# Altium schematic sheet 3 - 19V Buck.SchDoc: 19V Buck
size Letter; DrawnBy: Adrianna Ascalon; Organization: UW Robotics; Address1: 200 University Avenue; Address2: Waterloo; Address3: Ontario; Address4: Canada N2L 3G6
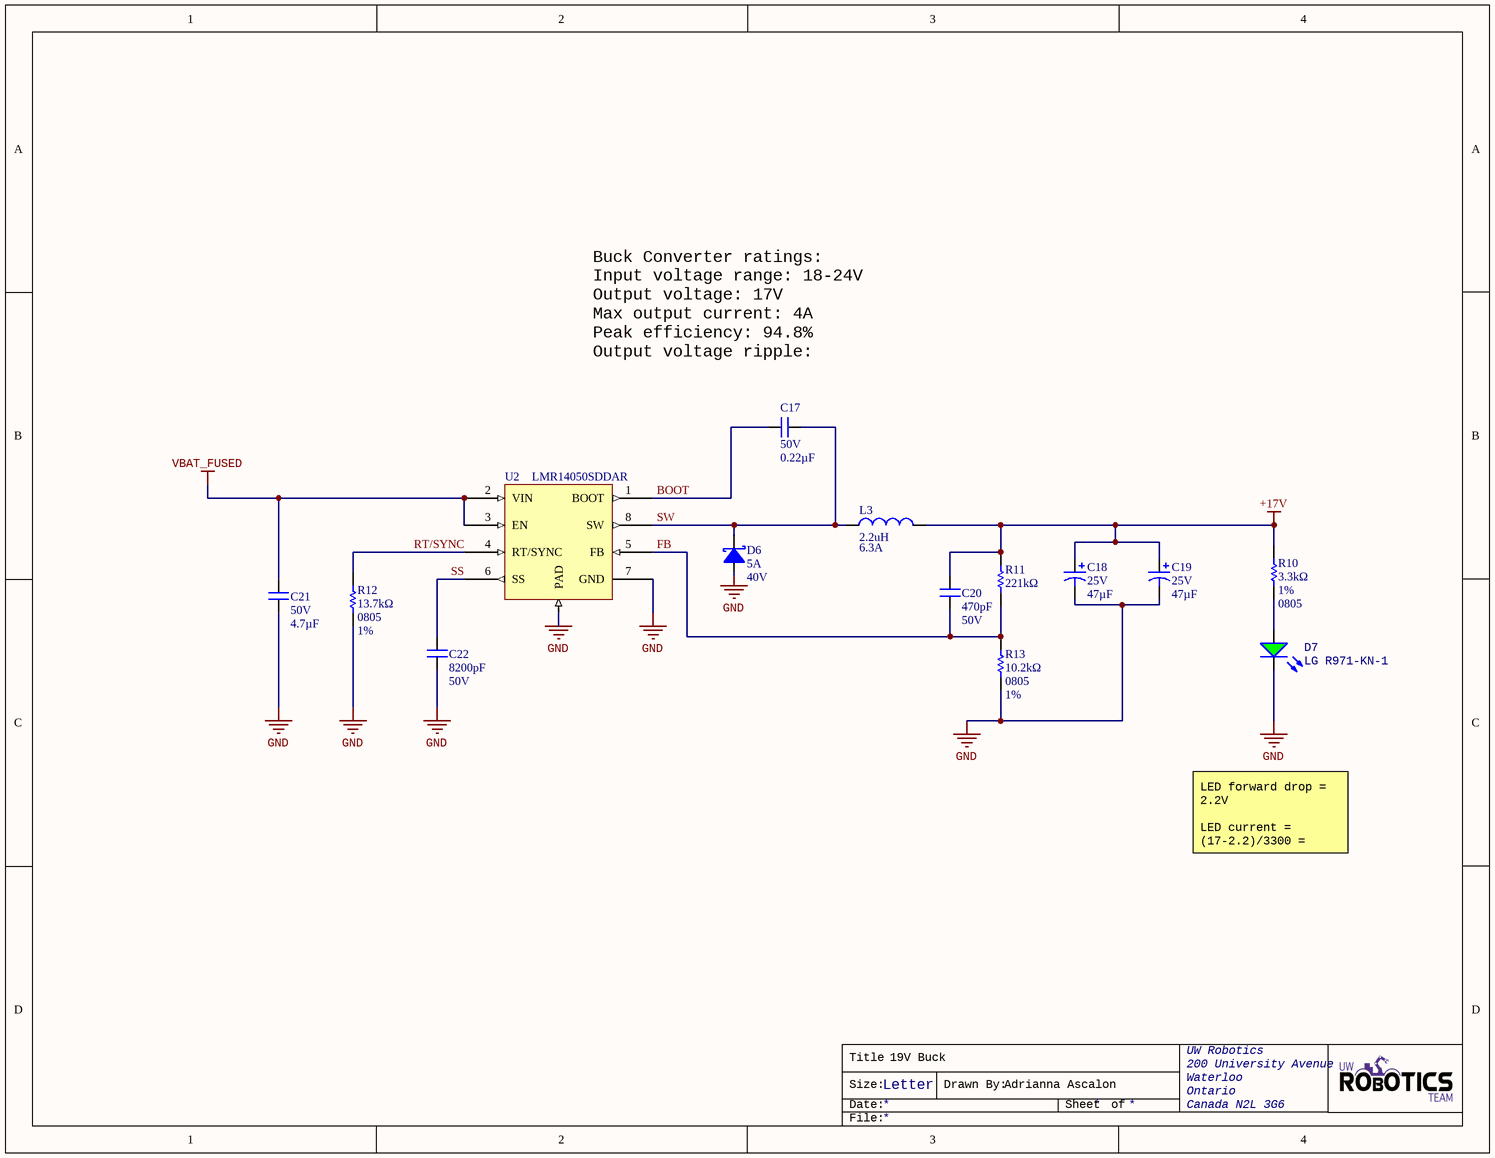
[diagram p0: 3 - 19V Buck.SchDoc]

## Parts
C17  Voltage Rating: 50V  Capacitance: 0.22µF  [CAP 0805_2012]  (hidden comment: GRM21BR71H224MA01L)
C18  Voltage: 25V  [25SVPF47M]  (hidden comment: 47μF)
C19  Voltage: 25V  [25SVPF47M]  (hidden comment: 47μF)
C20  470pF  Voltage Rating: 50V  [CAP 0805_2012]
C21  Voltage Rating: 50V  Capacitance: 4.7µF  [CAPC1206(3216)]  (hidden comment: GRM31CR71H475KA12L)
C22  8200pF  Voltage Rating: 50V
D6  Forward Current: 5A  Voltage: 40V  [DO214AB SMC]  (hidden comment: B540C-13-F)
D7  LG R971-KN-1  [LED_0805_LINE]
L3  Inductance: 2.2uH  Max DC Current: 6.3A  [IND_BOURNS_SRN80]  (hidden comment: SRN8040-2R2Y)
R10  3.3kΩ  Tolerance: 1%  Case Code (Imperial): 0805
R11  221kΩ  [RESC2012X60N]
R12  13.7kΩ  Case Code (Imperial): 0805  Tolerance: 1%  [RESC2012X60N]
R13  10.2kΩ  Case Code (Imperial): 0805  Tolerance: 1%  [RESC2012X60N]
U2  LMR14050SDDAR  [DDA8]

## Nets
+17V: C18.1 C19.1 C20.2 L3.2 R10.2 R11.2
GND: C18.2 C19.2 C21.2 C22.1 D6.1(Anode) D7.2(K) R12.1 R13.1 U2.7(GND) U2.9(PAD)
VBAT_FUSED: C21.1 U2.2(VIN) U2.3(EN)
BOOT: C17.2 U2.1(BOOT)
FB: C20.1 R11.1 R13.2 U2.5(FB)
RT/SYNC: R12.2 U2.4(RT/SYNC)
SS: C22.2 U2.6(SS)
SW: C17.1 D6.2(Cathode) L3.1 U2.8(SW)
NetD7_1: D7.1(A) R10.1

## Notes on the sheet
- Buck Converter ratings:
  Input voltage range: 18-24V
  Output voltage: 17V
  Max output current: 4A
  Peak efficiency: 94.8%
  Output voltage ripple: 19.45mVpp
- LED forward drop = 2.2V
  LED current = (17-2.2)/3300 = 4.5mA
- Title
- Size:
- Date:
- Letter
- Drawn By:
- Sheet
- of
- File:

## Library data of the parts
C17 = GRM21BR71H224MA01L: CAP CER 0.22UF 50V X7R 0805; Manufacturer 1: Murata; Tolerance: 20%; Manufacturer Part Number 1: GRM21BR71H224MA01L; Stock 1: 7809; Pricing 1: 1=0.33000, 10=0.23100, 100=0.13850, 500=0.10388, 1000=0.08772 (USD); RoHS: Yes; Mount: Surface Mount; Case/Package: 0805; Case Code (Metric): 2012; Case Code (Imperial): 0805; Min Operating Temperature: -55°C; Max Operating Temperature: 125°C; Package Quantity: 1; Packaging: Tape and Reel; Dielectric: X7R; Termination: SMD/SMT; Voltage Rating (DC): 50V; Length: 2mm; Height: 1.25mm; Width: 0.049inch; Thickness: 0.053inch; Depth: 1.25mm; Radiation Hardening: No; Lead Free: Lead Free; ComponentLink1URL: https://datasheet.ciiva.com/5421/product-5421097.pdf?src-supplier=Mouser; ComponentLink1Description: https://datasheet.ciiva.com/5421/product-5421097.pdf?src-supplier=Mouser; ComponentLink2URL: https://datasheet.ciiva.com/136/partnumbering-e-01-136536.pdf?src-supplier=Digi-Key; ComponentLink2Description: https://datasheet.ciiva.com/136/partnumbering-e-01-136536.pdf?src-supplier=Digi-Key; ComponentLink3URL: https://datasheet.ciiva.com/136/partnumbering-e-01-136537.pdf?src-supplier=Digi-Key; ComponentLink3Description: https://datasheet.ciiva.com/136/partnumbering-e-01-136537.pdf?src-supplier=Digi-Key; ComponentLink4URL: https://datasheet.ciiva.com/136/partnumbering-e-01-136538.pdf?src-supplier=Digi-Key; ComponentLink4Description: https://datasheet.ciiva.com/136/partnumbering-e-01-136538.pdf?src-supplier=Digi-Key; Supplier 1: Digi-Key; Supplier Part Number 1: 490-1671-1-ND; Package: 0805 (2012 Metric)
C18 C19 = 25SVPF47M: CAP ALUM POLY 47UF 20% 25V SMD; Manufacturer 1: Panasonic; Polarity: Polar; Leakage Current: 235uA; Life (Hours): 5000Hour; Dissipation Factor: 12%; ESR (Equivalent Series Resistance): 30mR; Ripple Current: 2.8A; Clamping Voltage: 35.5V; Peak Pulse Power: 400W; Reverse Standoff Voltage: 22V; Peak Pulse Current: 11.3A; Test Current: 1mA; Breakdown Voltage: 24.4V; Number of Channels: 1; Direction: Unidirectional; Max Reverse Leakage Current: 1uA; Element Configuration: Single; Max Breakdown Voltage: 26.9V; Max Forward Surge Current (Ifsm): 40A; Working Voltage: 3.5V; Current: 113A; Supplier 1: Digi-Key; Manufacturer Part Number 1: 25SVPF47M; Stock 1: 6381; Pricing 1: 1=1.29000, 10=1.02200, 100=0.76620, 500=0.57888 (USD); RoHS: Yes; Mount: Surface Mount; Case/Package: Radial; Number of Pins: 6; Min Operating Temperature: -55°C; Max Operating Temperature: 105°C; Termination: SMD/SMT; Tolerance: 20%; Packaging: Tape and Reel; Package Quantity: 1; Voltage Rating: 25V; Ripple Current (AC): 2.8A; Voltage Rating (DC): 25V; Diameter: 6.3mm; Length: 5.9mm; Height: 5.9mm; Height - Seated (Max): 0.236inch; REACH SVHC: No SVHC; ComponentLink1URL: https://datasheet.ciiva.com/22746/1734360-22746218.pdf?src-supplier=Element14; ComponentLink1Description: https://datasheet.ciiva.com/22746/1734360-22746218.pdf?src-supplier=Element14; ComponentLink2URL: https://datasheet.ciiva.com/24025/svpf-os-262415-24025725.pdf?src-supplier=Mouser; ComponentLink2Description: https://datasheet.ciiva.com/24025/svpf-os-262415-24025725.pdf?src-supplier=Mouser; ComponentLink3URL: https://datasheet.ciiva.com/48542/svpf-eng-ds-48542390.pdf?src-supplier=Distrelec; ComponentLink3Description: https://datasheet.ciiva.com/48542/svpf-eng-ds-48542390.pdf?src-supplier=Distrelec; ComponentLink4URL: https://datasheet.ciiva.com/25746/1734360-25746558.pdf?src-supplier=Farnell; ComponentLink4Description: https://datasheet.ciiva.com/25746/1734360-25746558.pdf?src-supplier=Farnell; Supplier Part Number 1: P16513CT-ND; Capacitance: 47µF; Max Surge Current: 11.3A; Operating Supply Voltage: 22V; Min Breakdown Voltage: 24.4V; Number of Elements: 1; Reverse Breakdown Voltage: 24.4V; Max Power Dissipation: 400W; Power Dissipation: 400W; Width: 0.11inch; Radiation Hardening: No; Lead Free: Lead Free; ComponentLink5URL: https://datasheet.ciiva.com/18426/70217282-18426662.pdf?src-supplier=Allied+Electronics; ComponentLink5Description: https://datasheet.ciiva.com/18426/70217282-18426662.pdf?src-supplier=Allied+Electronics; ComponentLink6URL: https://datasheet.ciiva.com/4508/smaj50a-241759-4508681.pdf?src-supplier=Mouser; ComponentLink6Description: https://datasheet.ciiva.com/4508/smaj50a-241759-4508681.pdf?src-supplier=Mouser
C20 = CAP_470pF_50V_0805: CAP CER 470PF 50V X7R 0805; Manufacturer 1: Kyocera AVX; Manufacturer Part Number 1: 08055C471JAT2A; Tolerance: 5%; Dissipation Factor: 2.5%; Supplier 1: Digi-Key; Stock 1: 6535; Pricing 1: 1=0.32000, 10=0.22000, 100=0.12470, 500=0.08804, 1000=0.07704 (USD); RoHS: Yes; Mount: Surface Mount; Number of Pins: 2; Case Code (Metric): 2012; Case Code (Imperial): 0805; Min Operating Temperature: -55°C; Max Operating Temperature: 125°C; Dielectric: X7R; Package Quantity: 1; Packaging: Tape and Reel; Voltage Rating (DC): 50V; Termination: SMD/SMT; Length: 2.01mm; Height: 0.94mm; Width: 0.049inch; Thickness: 0.037inch; Depth: 1.25mm; Radiation Hardening: No; REACH SVHC: Unknown; ComponentLink1URL: https://datasheet.ciiva.com/17487/cx7r-17487814.pdf?src-supplier=Avnet+Europe; ComponentLink1Description: https://datasheet.ciiva.com/17487/cx7r-17487814.pdf?src-supplier=Avnet+Europe; ComponentLink2URL: https://datasheet.ciiva.com/7614/cx7r-7614649.pdf?src-supplier=Digi-Key; ComponentLink2Description: https://datasheet.ciiva.com/7614/cx7r-7614649.pdf?src-supplier=Digi-Key; ComponentLink3URL: https://datasheet.ciiva.com/206/cx7r-206811.pdf?src-supplier=Digi-Key; ComponentLink3Description: https://datasheet.ciiva.com/206/cx7r-206811.pdf?src-supplier=Digi-Key; ComponentLink4URL: https://datasheet.ciiva.com/14906/cx7r-14906251.pdf?src-supplier=Digi-Key; ComponentLink4Description: https://datasheet.ciiva.com/14906/cx7r-14906251.pdf?src-supplier=Digi-Key; ComponentLink5URL: https://datasheet.ciiva.com/11521/cx7r-11521036.pdf?src-supplier=Avnet; ComponentLink5Description: https://datasheet.ciiva.com/11521/cx7r-11521036.pdf?src-supplier=Avnet; ComponentLink6URL: https://datasheet.ciiva.com/5415/cx7r-218113-5415709.pdf?src-supplier=Mouser; ComponentLink6Description: https://datasheet.ciiva.com/5415/cx7r-218113-5415709.pdf?src-supplier=Mouser; ComponentLink7URL: https://datasheet.ciiva.com/14906/cx7r-14906253.pdf?src-supplier=Digi-Key; ComponentLink7Description: https://datasheet.ciiva.com/14906/cx7r-14906253.pdf?src-supplier=Digi-Key; Supplier Part Number 1: 478-7958-1-ND; Capacitance: 470pF; Package: 0805 (2012 Metric); Contact Plating: Tin,Matte
C21 = GRM31CR71H475KA12L: CAP CER 4.7UF 50V X7R 1206; Manufacturer 1: Murata; Material: Ceramic; Tolerance: 10%; Value: 4.7µF; Supplier 1: Digi-Key; Manufacturer Part Number 1: GRM31CR71H475KA12L; Stock 1: 12089; Pricing 1: 1=0.86000, 10=0.63700, 100=0.43660, 500=0.34562, 1000=0.29105 (USD); RoHS: Yes; Mount: Surface Mount; Case/Package: 1206; Case Code (Metric): 3216; Case Code (Imperial): 1206; Min Operating Temperature: -55°C; Max Operating Temperature: 125°C; Dielectric: X7R; Packaging: Tape and Reel; Voltage Rating (DC): 50V; Package Quantity: 2000; Termination: SMD/SMT; Voltage: 50V; Length: 3.2mm; Height: 1.6mm; Width: 0.063inch; Thickness: 0.071inch; Depth: 1.6mm; Radiation Hardening: No; REACH SVHC: No SVHC; Lead Free: Lead Free; ComponentLink1URL: https://datasheet.ciiva.com/6072/415379-6072784.pdf?src-supplier=Farnell; ComponentLink1Description: https://datasheet.ciiva.com/6072/415379-6072784.pdf?src-supplier=Farnell; ComponentLink2URL: https://datasheet.ciiva.com/3777/2267grm31cr71h475ka1223-3777241.pdf?src-supplier=Arrow; ComponentLink2Description: https://datasheet.ciiva.com/3777/2267grm31cr71h475ka1223-3777241.pdf?src-supplier=Arrow; ComponentLink3URL: https://datasheet.ciiva.com/29202/450972-da-01-de-vs-chip-kond-1206-4-7-uf-10pr-50-0v-x7r-29202576.pdf?src-supplier=Conrad; ComponentLink3Description: https://datasheet.ciiva.com/29202/450972-da-01-de-vs-chip-kond-1206-4-7-uf-10pr-50-0v-x7r-29202576.pdf?src-supplier=Conrad; ComponentLink4URL: https://datasheet.ciiva.com/29202/451279-da-01-de-vs-kondens-grm31-cr71h-475ka12l-29202365.pdf?src-supplier=Conrad; ComponentLink4Description: https://datasheet.ciiva.com/29202/451279-da-01-de-vs-kondens-grm31-cr71h-475ka12l-29202365.pdf?src-supplier=Conrad; ComponentLink5URL: https://datasheet.ciiva.com/7937/415310-7937749.pdf?src-supplier=Element14; ComponentLink5Description: https://datasheet.ciiva.com/7937/415310-7937749.pdf?src-supplier=Element14; ComponentLink6URL: https://datasheet.ciiva.com/6270/partnumbering-e-01-6270217.pdf?src-supplier=Digi-Key; ComponentLink6Description: https://datasheet.ciiva.com/6270/partnumbering-e-01-6270217.pdf?src-supplier=Digi-Key; ComponentLink7URL: https://datasheet.ciiva.com/6270/partnumbering-e-01-6270218.pdf?src-supplier=Digi-Key; ComponentLink7Description: https://datasheet.ciiva.com/6270/partnumbering-e-01-6270218.pdf?src-supplier=Digi-Key; ComponentLink8URL: https://datasheet.ciiva.com/6270/partnumbering-e-01-6270219.pdf?src-supplier=Digi-Key; ComponentLink8Description: https://datasheet.ciiva.com/6270/partnumbering-e-01-6270219.pdf?src-supplier=Digi-Key; Supplier Part Number 1: 490-6521-1-ND; Package: 1206 (3216 Metric)
C22 = CAP_8200pF_50V_0805: CAP CER 8200PF 50V X7R 0805; Tolerance: 10%; Capacitance: 8.2nF; RoHS: Yes; Mount: Surface Mount; Case Code (Metric): 2012; Case Code (Imperial): 0805; Min Operating Temperature: -55°C; Max Operating Temperature: 125°C; Dielectric: X7R; Package Quantity: 12000; Voltage Rating (DC): 50V; Termination: SMD/SMT; Packaging: Tape and Reel; Length: 0.079inch; Width: 0.049inch; Thickness: 0.037inch; Depth: 1.25mm; Radiation Hardening: No; ComponentLink1URL: https://datasheet.ciiva.com/205/cauto-205227.pdf?src-supplier=Digi-Key; ComponentLink1Description: https://datasheet.ciiva.com/205/cauto-205227.pdf?src-supplier=Digi-Key; Supplier 1: Digi-Key; Supplier Part Number 1: 478-9924-6-ND; Number of Pins: 2; Ratings: AEC-Q200; Package: 0805 (2012 Metric)
D6 = B540C-13-F: Diode Schottky 40V 5A Surface Mount SMC; Manufacturer 1: Diodes; Element Configuration: Single; Peak Reverse Current: 500uA; Peak Non-Repetitive Surge Current: 100A; Forward Voltage: 550mV; Polarity: Standard; Capacitance: 300pF; Supplier 1: Digi-Key; Manufacturer Part Number 1: B540C-13-F; Stock 1: 27000; Pricing 1: 1=0.49000, 10=0.41700, 25=0.38880, 100=0.28890, 250=0.27440, 500=0.22554, 1000=0.18332 (USD); RoHS: Yes; Mount: Surface Mount; Case/Package: SMC; Number of Pins: 2; Weight: 0.007408oz; Contact Plating: Tin,Matte; Min Operating Temperature: -55°C; Max Operating Temperature: 125°C; Max Repetitive Reverse Voltage (Vrrm): 40V; Packaging: Tape and Reel; Max Forward Surge Current (Ifsm): 100A; Package Quantity: 3000; Average Rectified Current: 5A; Termination: SMD/SMT; Voltage Rating (DC): 40V; Current Rating: 5A; Output Current: 5A; Max Reverse Voltage (DC): 40V; Current: 5A; Length: 7.11mm; Height: 2.5mm; Width: 6.22mm; Radiation Hardening: No; REACH SVHC: No SVHC; Lead Free: Lead Free; ComponentLink1URL: https://datasheet.ciiva.com/914/ds13012-914960.pdf?src-supplier=Digi-Key; ComponentLink1Description: https://datasheet.ciiva.com/914/ds13012-914960.pdf?src-supplier=Digi-Key; ComponentLink2URL: https://datasheet.ciiva.com/26949/getdatasheetpartid-184980-26949363.pdf?src-supplier=Verical; ComponentLink2Description: https://datasheet.ciiva.com/26949/getdatasheetpartid-184980-26949363.pdf?src-supplier=Verical; ComponentLink3URL: https://datasheet.ciiva.com/26788/b540c-13-f-26788854.pdf?src-supplier=IIIC; ComponentLink3Description: https://datasheet.ciiva.com/26788/b540c-13-f-26788854.pdf?src-supplier=IIIC; ComponentLink4URL: https://datasheet.ciiva.com/1177/ds13012-1177530.pdf?src-supplier=Element14; ComponentLink4Description: https://datasheet.ciiva.com/1177/ds13012-1177530.pdf?src-supplier=Element14; ComponentLink5URL: https://datasheet.ciiva.com/914/ds13012-914958.pdf?src-supplier=Digi-Key; ComponentLink5Description: https://datasheet.ciiva.com/914/ds13012-914958.pdf?src-supplier=Digi-Key; ComponentLink6URL: https://datasheet.ciiva.com/914/ds13012-914959.pdf?src-supplier=Digi-Key; ComponentLink6Description: https://datasheet.ciiva.com/914/ds13012-914959.pdf?src-supplier=Digi-Key; ComponentLink7URL: https://datasheet.ciiva.com/8303/ds13012-8303112.pdf?src-supplier=Avnet; ComponentLink7Description: https://datasheet.ciiva.com/8303/ds13012-8303112.pdf?src-supplier=Avnet; ComponentLink8URL: https://datasheet.ciiva.com/25919/ds13012-25919706.pdf?src-supplier=Avnet+Europe; ComponentLink8Description: https://datasheet.ciiva.com/25919/ds13012-25919706.pdf?src-supplier=Avnet+Europe; ComponentLink9URL: https://datasheet.ciiva.com/16200/ds13012-16200443.pdf?src-supplier=Future+Electronics; ComponentLink9Description: https://datasheet.ciiva.com/16200/ds13012-16200443.pdf?src-supplier=Future+Electronics; Supplier Part Number 1: B540C-FDIDKR-ND
D7 = DIO_LED_G: LED GREEN DIFFUSED 0805 SMD; Manufacturer 1: OSRAM; Forward Voltage Drop: 2.2V; Package: 0805 (2012 Metric); Manufacturer Part Number 1: LG R971-KN-1; Supplier Part Number 1: 475-1410-1-ND; Supplier 1: Digi-Key; Mount: Surface Mount
L3 = SRN8040-2R2Y: FIXED IND 2.2UH 6.3A 13 MOHM SMD; Manufacturer 1: Bourns; Core Material: Ferrite; Material: Steel; DC Resistance (DCR): 13mR; Tolerance: 30%; Self Resonant Frequency: 40MHz; Test Frequency: 100kHz; Shielding: Shielded; Saturation Current: 7.4A; Supplier 1: Digi-Key; Manufacturer Part Number 1: SRN8040-2R2Y; Stock 1: 4815; Pricing 1: 1=0.78000, 10=0.68400, 100=0.48880, 500=0.41056 (USD); RoHS: Yes; Mount: Surface Mount; Case/Package: Nonstandard; Number of Pins: 2; Weight: 0.028607oz; Contact Plating: Tin; Min Operating Temperature: -40°C; Max Operating Temperature: 125°C; Termination: SMD/SMT; Composition: Wirewound; DC Current: 6.3A; Military Standard: Not; RMS Current (Irms): 6.3A; Package Quantity: 1000; Packaging: Tape and Reel; Inductance Tolerance: 30%; Current Rating: 6.3A; Length: 8mm; Height: 4mm; Height - Seated (Max): 0.157inch; Depth: 8.3mm; Width: 8mm; REACH SVHC: No SVHC; ComponentLink1URL: https://datasheet.ciiva.com/11802/0900766b80fe1f3f-11802605.pdf?src-supplier=RSComponents; ComponentLink1Description: https://datasheet.ciiva.com/11802/0900766b80fe1f3f-11802605.pdf?src-supplier=RSComponents; ComponentLink2URL: https://datasheet.ciiva.com/28678/srn8040-28678249.pdf?src-supplier=Element14; ComponentLink2Description: https://datasheet.ciiva.com/28678/srn8040-28678249.pdf?src-supplier=Element14; ComponentLink3URL: https://datasheet.ciiva.com/8515/srn8040-8515258.pdf?src-supplier=Avnet; ComponentLink3Description: https://datasheet.ciiva.com/8515/srn8040-8515258.pdf?src-supplier=Avnet; ComponentLink4URL: https://datasheet.ciiva.com/7847/1865628-7847915.pdf?src-supplier=Element14; ComponentLink4Description: https://datasheet.ciiva.com/7847/1865628-7847915.pdf?src-supplier=Element14; ComponentLink5URL: https://datasheet.ciiva.com/1049/srn8040-1049453.pdf?src-supplier=Digi-Key; ComponentLink5Description: https://datasheet.ciiva.com/1049/srn8040-1049453.pdf?src-supplier=Digi-Key; ComponentLink6URL: https://datasheet.ciiva.com/1049/srn8040-1049454.pdf?src-supplier=Digi-Key; ComponentLink6Description: https://datasheet.ciiva.com/1049/srn8040-1049454.pdf?src-supplier=Digi-Key; ComponentLink7URL: https://datasheet.ciiva.com/1049/srn8040-1049455.pdf?src-supplier=Digi-Key; ComponentLink7Description: https://datasheet.ciiva.com/1049/srn8040-1049455.pdf?src-supplier=Digi-Key; ComponentLink8URL: https://datasheet.ciiva.com/17284/srn8040-17284783.pdf?src-supplier=Avnet+Europe; ComponentLink8Description: https://datasheet.ciiva.com/17284/srn8040-17284783.pdf?src-supplier=Avnet+Europe; ComponentLink9URL: https://datasheet.ciiva.com/48691/001056460-da-01-en-mag-abg-leist-ind-srn8040-2r2y-2-2uh-smd-48691836.pdf?src-supplier=Conrad; ComponentLink9Description: https://datasheet.ciiva.com/48691/001056460-da-01-en-mag-abg-leist-ind-srn8040-2r2y-2-2uh-smd-48691836.pdf?src-supplier=Conrad; Supplier Part Number 1: SRN8040-2R2YCT-ND
R10 = RES_3.3kΩ_0805: RES SMD 3.3K OHM 1% 1/8W 0805; Resistance: 3.3kR; Temperature Coefficient: 100ppm/°C; Power Rating: 125mW; Voltage Rating: 150V; Package: 0805 (2012 Metric); Supplier 1: Digi-Key; Mount: Surface Mount; Case Code (Metric): 2012; RoHS: Yes; Weight: 0.000194oz; Contact Plating: Tin; Min Operating Temperature: -55°C; Max Operating Temperature: 155°C; Packaging: Tape and Reel; Composition: Thick Film; Number of Terminations: 2; Termination: SMD/SMT; Max Power Dissipation: 125mW; Package Quantity: 10; Voltage Rating (DC): 150V; Features: Automotive AEC-Q200; Military Standard: Not; Length: 2mm; Height: 0.45mm; Width: 1.25mm; Depth: 1.25mm; Radiation Hardening: No; Lead Free: Lead Free; REACH SVHC: Unknown; ComponentLink1URL: https://datasheet.ciiva.com/11811/0900766b80d98b26-11811135.pdf?src-supplier=RSComponents; ComponentLink1Description: https://datasheet.ciiva.com/11811/0900766b80d98b26-11811135.pdf?src-supplier=RSComponents; ComponentLink2URL: https://datasheet.ciiva.com/7673/1720486-7673157.pdf?src-supplier=Element14; ComponentLink2Description: https://datasheet.ciiva.com/7673/1720486-7673157.pdf?src-supplier=Element14; ComponentLink3URL: https://datasheet.ciiva.com/7672/1697337-7672998.pdf?src-supplier=Element14; ComponentLink3Description: https://datasheet.ciiva.com/7672/1697337-7672998.pdf?src-supplier=Element14; ComponentLink4URL: https://datasheet.ciiva.com/5551/dcrcwe3-109170-5551626.pdf?src-supplier=Mouser; ComponentLink4Description: https://datasheet.ciiva.com/5551/dcrcwe3-109170-5551626.pdf?src-supplier=Mouser; ComponentLink5URL: https://datasheet.ciiva.com/2467/dcrcwe3-2467821.pdf?src-supplier=Digi-Key; ComponentLink5Description: https://datasheet.ciiva.com/2467/dcrcwe3-2467821.pdf?src-supplier=Digi-Key; ComponentLink6URL: https://datasheet.ciiva.com/2467/dcrcwe3-2467822.pdf?src-supplier=Digi-Key; ComponentLink6Description: https://datasheet.ciiva.com/2467/dcrcwe3-2467822.pdf?src-supplier=Digi-Key; ComponentLink7URL: https://datasheet.ciiva.com/2467/dcrcwe3-2467823.pdf?src-supplier=Digi-Key; ComponentLink7Description: https://datasheet.ciiva.com/2467/dcrcwe3-2467823.pdf?src-supplier=Digi-Key; ComponentLink8URL: https://datasheet.ciiva.com/9080/dcrcwe3-9080591.pdf?src-supplier=Avnet; ComponentLink8Description: https://datasheet.ciiva.com/9080/dcrcwe3-9080591.pdf?src-supplier=Avnet; ComponentLink9URL: https://datasheet.ciiva.com/16430/dcrcwe3-16430277.pdf?src-supplier=Future+Electronics; ComponentLink9Description: https://datasheet.ciiva.com/16430/dcrcwe3-16430277.pdf?src-supplier=Future+Electronics; ComponentLink10URL: https://datasheet.ciiva.com/26312/fld-crcw-e3-data-en-26312934.pdf?src-supplier=Distrelec; ComponentLink10Description: https://datasheet.ciiva.com/26312/fld-crcw-e3-data-en-26312934.pdf?src-supplier=Distrelec; ComponentLink11URL: https://datasheet.ciiva.com/16778/70201119-16778680.pdf?src-supplier=Allied+Electronics; ComponentLink11Description: https://datasheet.ciiva.com/16778/70201119-16778680.pdf?src-supplier=Allied+Electronics; Supplier Part Number 1: 541-3.30KHCT-ND
R11 = RES_221kΩ_0805: RES SMD 221K OHM 1% 1/8W 0805; Manufacturer 1: Vishay; Manufacturer Part Number 1: CRCW0805221KFKEA; Power Rating: 125mW; Voltage Rating: 150V; Temperature Coefficient: 100ppm/°C; Resistance: 221kR; Supplier 1: Digi-Key; Stock 1: 5246; Pricing 1: 1=0.10000, 10=0.06200, 100=0.02540, 1000=0.01142, 2500=0.00991 (USD); RoHS: Yes; Mount: Surface Mount; Contact Plating: Tin; Case Code (Metric): 2012; Case Code (Imperial): 0805; Min Operating Temperature: -55°C; Max Operating Temperature: 155°C; Packaging: Tape and Reel; Package Quantity: 5000; Voltage Rating (DC): 150V; Composition: Thick Film; Number of Terminations: 2; Termination: SMD/SMT; Military Standard: Not; Features: Automotive AEC-Q200; Length: 2mm; Height: 0.45mm; Width: 1.25mm; Depth: 1.25mm; REACH SVHC: Unknown; Lead Free: Lead Free; ComponentLink1URL: https://datasheet.ciiva.com/11810/0900766b80d98b26-11810355.pdf?src-supplier=RSComponents; ComponentLink1Description: https://datasheet.ciiva.com/11810/0900766b80d98b26-11810355.pdf?src-supplier=RSComponents; ComponentLink2URL: https://datasheet.ciiva.com/2467/dcrcwe3-2467620.pdf?src-supplier=Digi-Key; ComponentLink2Description: https://datasheet.ciiva.com/2467/dcrcwe3-2467620.pdf?src-supplier=Digi-Key; ComponentLink3URL: https://datasheet.ciiva.com/2467/dcrcwe3-2467621.pdf?src-supplier=Digi-Key; ComponentLink3Description: https://datasheet.ciiva.com/2467/dcrcwe3-2467621.pdf?src-supplier=Digi-Key; ComponentLink4URL: https://datasheet.ciiva.com/7674/1697337-7674101.pdf?src-supplier=Element14; ComponentLink4Description: https://datasheet.ciiva.com/7674/1697337-7674101.pdf?src-supplier=Element14; ComponentLink5URL: https://datasheet.ciiva.com/16389/dcrcwe3-16389893.pdf?src-supplier=Future+Electronics; ComponentLink5Description: https://datasheet.ciiva.com/16389/dcrcwe3-16389893.pdf?src-supplier=Future+Electronics; ComponentLink6URL: https://datasheet.ciiva.com/16759/70201119-16759029.pdf?src-supplier=Allied+Electronics; ComponentLink6Description: https://datasheet.ciiva.com/16759/70201119-16759029.pdf?src-supplier=Allied+Electronics; ComponentLink7URL: https://datasheet.ciiva.com/2467/dcrcwe3-2467622.pdf?src-supplier=Digi-Key; ComponentLink7Description: https://datasheet.ciiva.com/2467/dcrcwe3-2467622.pdf?src-supplier=Digi-Key; ComponentLink8URL: https://datasheet.ciiva.com/3258/dcrcwe3-3258329.pdf?src-supplier=Avnet; ComponentLink8Description: https://datasheet.ciiva.com/3258/dcrcwe3-3258329.pdf?src-supplier=Avnet; Supplier Part Number 1: 541-221KCCT-ND; Max Power Dissipation: 125mW; Tolerance: 1%; Number of Pins: 2; Weight: 0.000194oz; Radiation Hardening: No; ComponentLink9URL: https://datasheet.ciiva.com/7674/1533075-7674218.pdf?src-supplier=Element14; ComponentLink9Description: https://datasheet.ciiva.com/7674/1533075-7674218.pdf?src-supplier=Element14; ComponentLink10URL: https://datasheet.ciiva.com/22870/70201119-22870172.pdf?src-supplier=Allied+Electronics; ComponentLink10Description: https://datasheet.ciiva.com/22870/70201119-22870172.pdf?src-supplier=Allied+Electronics; Package: 0805 (2012 Metric)
R12 = RES_13.7kΩ_0805: RES SMD 13.7K OHM 1% 1/8W 0805; Manufacturer 1: Vishay; Manufacturer Part Number 1: CRCW080513K7FKEA; Temperature Coefficient: 100ppm/°C; Voltage Rating (DC): 150V; Power Rating: 125mW; Resistance: 13.7kR; Supplier 1: Digi-Key; Stock 1: 186591; Pricing 1: 1=0.10000, 10=0.06200, 100=0.02540, 1000=0.01142, 2500=0.00991 (USD); RoHS: Yes; Number of Pins: 2; Weight: 0.000194oz; Case Code (Metric): 2012; Contact Plating: Tin; Min Operating Temperature: -55°C; Max Operating Temperature: 155°C; Packaging: Tape and Reel; Package Quantity: 10; Composition: Thick Film; Termination: SMD/SMT; Military Standard: Not; Length: 2mm; Height: 0.45mm; Width: 0.049inch; Depth: 1.25mm; Radiation Hardening: No; Lead Free: Lead Free; REACH SVHC: Unknown; ComponentLink1URL: https://datasheet.ciiva.com/11810/0900766b80d98b26-11810040.pdf?src-supplier=RSComponents; ComponentLink1Description: https://datasheet.ciiva.com/11810/0900766b80d98b26-11810040.pdf?src-supplier=RSComponents; ComponentLink2URL: https://datasheet.ciiva.com/2467/dcrcwe3-2467845.pdf?src-supplier=Digi-Key; ComponentLink2Description: https://datasheet.ciiva.com/2467/dcrcwe3-2467845.pdf?src-supplier=Digi-Key; ComponentLink3URL: https://datasheet.ciiva.com/5543/dcrcwe3-109170-5543941.pdf?src-supplier=Mouser; ComponentLink3Description: https://datasheet.ciiva.com/5543/dcrcwe3-109170-5543941.pdf?src-supplier=Mouser; ComponentLink4URL: https://datasheet.ciiva.com/2467/dcrcwe3-2467846.pdf?src-supplier=Digi-Key; ComponentLink4Description: https://datasheet.ciiva.com/2467/dcrcwe3-2467846.pdf?src-supplier=Digi-Key; ComponentLink5URL: https://datasheet.ciiva.com/16396/dcrcw-16396310.pdf?src-supplier=Future+Electronics; ComponentLink5Description: https://datasheet.ciiva.com/16396/dcrcw-16396310.pdf?src-supplier=Future+Electronics; Supplier Part Number 1: 541-13.7KCCT-ND; Voltage Rating: 150V; Number of Terminations: 2; Max Power Dissipation: 125mW; Features: Automotive AEC-Q200; ComponentLink6URL: https://datasheet.ciiva.com/2467/dcrcwe3-2467847.pdf?src-supplier=Digi-Key; ComponentLink6Description: https://datasheet.ciiva.com/2467/dcrcwe3-2467847.pdf?src-supplier=Digi-Key; ComponentLink7URL: https://datasheet.ciiva.com/22675/1847332-22675191.pdf?src-supplier=Element14; ComponentLink7Description: https://datasheet.ciiva.com/22675/1847332-22675191.pdf?src-supplier=Element14; ComponentLink8URL: https://datasheet.ciiva.com/7663/1697337-7663928.pdf?src-supplier=Element14; ComponentLink8Description: https://datasheet.ciiva.com/7663/1697337-7663928.pdf?src-supplier=Element14; ComponentLink9URL: https://datasheet.ciiva.com/3258/dcrcwe3-3258107.pdf?src-supplier=Avnet; ComponentLink9Description: https://datasheet.ciiva.com/3258/dcrcwe3-3258107.pdf?src-supplier=Avnet; ComponentLink10URL: https://datasheet.ciiva.com/16778/70201119-16778860.pdf?src-supplier=Allied+Electronics; ComponentLink10Description: https://datasheet.ciiva.com/16778/70201119-16778860.pdf?src-supplier=Allied+Electronics; ComponentLink11URL: https://datasheet.ciiva.com/17188/dcrcwe3-17188109.pdf?src-supplier=Avnet+Europe; ComponentLink11Description: https://datasheet.ciiva.com/17188/dcrcwe3-17188109.pdf?src-supplier=Avnet+Europe; Package: 0805 (2012 Metric)
R13 = RES_10.2kΩ_0805: RES SMD 10.2K OHM 1% 1/8W 0805; Manufacturer 1: Vishay; Manufacturer Part Number 1: CRCW080510K2FKEA; Temperature Coefficient: 100ppm/°C; Power Rating: 125mW; Voltage Rating: 150V; Resistance: 10.2kR; Supplier 1: Digi-Key; Stock 1: 7147; Pricing 1: 1=0.10000, 10=0.06200, 100=0.02540, 1000=0.01142, 2500=0.00991 (USD); RoHS: Yes; Number of Pins: 2; Weight: 0.000194oz; Contact Plating: Tin; Case Code (Metric): 2012; Min Operating Temperature: -55°C; Max Operating Temperature: 155°C; Packaging: Tape and Reel; Composition: Thick Film; Features: Automotive AEC-Q200; Package Quantity: 10; Termination: SMD/SMT; Number of Terminations: 2; Military Standard: Not; Length: 2mm; Height: 0.45mm; Width: 0.049inch; Depth: 1.25mm; Radiation Hardening: No; REACH SVHC: Unknown; ComponentLink1URL: https://datasheet.ciiva.com/11810/0900766b80d98b26-11810883.pdf?src-supplier=RSComponents; ComponentLink1Description: https://datasheet.ciiva.com/11810/0900766b80d98b26-11810883.pdf?src-supplier=RSComponents; ComponentLink2URL: https://datasheet.ciiva.com/2496/dcrcwe3-2496241.pdf?src-supplier=Digi-Key; ComponentLink2Description: https://datasheet.ciiva.com/2496/dcrcwe3-2496241.pdf?src-supplier=Digi-Key; ComponentLink3URL: https://datasheet.ciiva.com/2496/dcrcwe3-2496242.pdf?src-supplier=Digi-Key; ComponentLink3Description: https://datasheet.ciiva.com/2496/dcrcwe3-2496242.pdf?src-supplier=Digi-Key; ComponentLink4URL: https://datasheet.ciiva.com/2496/dcrcwe3-2496243.pdf?src-supplier=Digi-Key; ComponentLink4Description: https://datasheet.ciiva.com/2496/dcrcwe3-2496243.pdf?src-supplier=Digi-Key; ComponentLink5URL: https://datasheet.ciiva.com/8337/dcrcwe3-8337525.pdf?src-supplier=Avnet; ComponentLink5Description: https://datasheet.ciiva.com/8337/dcrcwe3-8337525.pdf?src-supplier=Avnet; ComponentLink6URL: https://datasheet.ciiva.com/5542/dcrcwe3-109170-5542214.pdf?src-supplier=Mouser; ComponentLink6Description: https://datasheet.ciiva.com/5542/dcrcwe3-109170-5542214.pdf?src-supplier=Mouser; ComponentLink7URL: https://datasheet.ciiva.com/22702/1697337-22702902.pdf?src-supplier=Element14; ComponentLink7Description: https://datasheet.ciiva.com/22702/1697337-22702902.pdf?src-supplier=Element14; ComponentLink8URL: https://datasheet.ciiva.com/16204/dcrcwe3-16204135.pdf?src-supplier=Future+Electronics; ComponentLink8Description: https://datasheet.ciiva.com/16204/dcrcwe3-16204135.pdf?src-supplier=Future+Electronics; ComponentLink9URL: https://datasheet.ciiva.com/16852/dcrcwe3-16852825.pdf?src-supplier=Avnet+Europe; ComponentLink9Description: https://datasheet.ciiva.com/16852/dcrcwe3-16852825.pdf?src-supplier=Avnet+Europe; ComponentLink10URL: https://datasheet.ciiva.com/7663/1697337-7663915.pdf?src-supplier=Element14; ComponentLink10Description: https://datasheet.ciiva.com/7663/1697337-7663915.pdf?src-supplier=Element14; ComponentLink11URL: https://datasheet.ciiva.com/7663/1697337-7663916.pdf?src-supplier=Element14; ComponentLink11Description: https://datasheet.ciiva.com/7663/1697337-7663916.pdf?src-supplier=Element14; ComponentLink12URL: https://datasheet.ciiva.com/22674/1825492-22674606.pdf?src-supplier=Element14; ComponentLink12Description: https://datasheet.ciiva.com/22674/1825492-22674606.pdf?src-supplier=Element14; ComponentLink13URL: https://datasheet.ciiva.com/3258/dcrcwe3-3258031.pdf?src-supplier=Avnet; ComponentLink13Description: https://datasheet.ciiva.com/3258/dcrcwe3-3258031.pdf?src-supplier=Avnet; Supplier Part Number 1: 541-10.2KCCT-ND; Max Power Dissipation: 125mW; Package: 0805 (2012 Metric); Voltage Rating (DC): 150V; Working Voltage: 150V; Lead Free: Lead Free
U2 = LMR14050SDDAR: Buck, 40V, 5A  2.2MHz Step-Down Regulator with 40µA IQ 8-SO PowerPAD -40 to 125; Manufacturer 1: Texas Instruments; Output Type: Adjustable; Output Configuration: Positive; Number of Outputs: 1; Min Input Voltage: 4V; Min Output Voltage: 800mV; Max Output Voltage: 28V; Switching Frequency: 2.5MHz; Synchronous Rectifier: No; Quiescent Current: 40uA; Supplier 1: Digi-Key; Manufacturer Part Number 1: LMR14050SDDAR; Stock 1: 5816; Pricing 1: 1=2.80000, 10=2.51300, 25=2.37600, 100=1.95360, 250=1.75296, 500=1.68960, 1000=1.40448 (USD); RoHS: Yes; Mount: Surface Mount; Number of Pins: 8; Min Operating Temperature: -40°C; Max Operating Temperature: 125°C; Packaging: Cut Tape; Max Input Voltage: 40V; Output Current: 5A; Lead Free: Lead Free; ComponentLink1URL: http://www.ti.com/general/docs/lit/getliterature.tsp?genericPartNumber=LMR14050&&fileType=pdf&src-supplier=Avnet; ComponentLink1Description: http://www.ti.com/general/docs/lit/getliterature.tsp?genericPartNumber=LMR14050&&fileType=pdf&src-supplier=Avnet; ComponentLink2URL: http://www.ti.com/lit/ds/symlink/lmr14050.pdf?src-supplier=Digi-Key; ComponentLink2Description: http://www.ti.com/lit/ds/symlink/lmr14050.pdf?src-supplier=Digi-Key; ComponentLink3URL: http://www.ti.com/general/docs/suppproductinfo.tsp?distId=10&amp;gotoUrl=http%3A%2F%2Fwww.ti.com%2Flit%2Fgpn%2Flmr14050&src-supplier=Digi-Key; ComponentLink3Description: http://www.ti.com/general/docs/suppproductinfo.tsp?distId=10&amp;gotoUrl=http%3A%2F%2Fwww.ti.com%2Flit%2Fgpn%2Flmr14050&src-supplier=Digi-Key; Case/Package: 8-PowerSOIC; Supplier Part Number 1: 296-44322-1-ND